# Altium schematic sheet 08 CAMERA, EXP PORT.SchDoc
size 513 x 386 mm
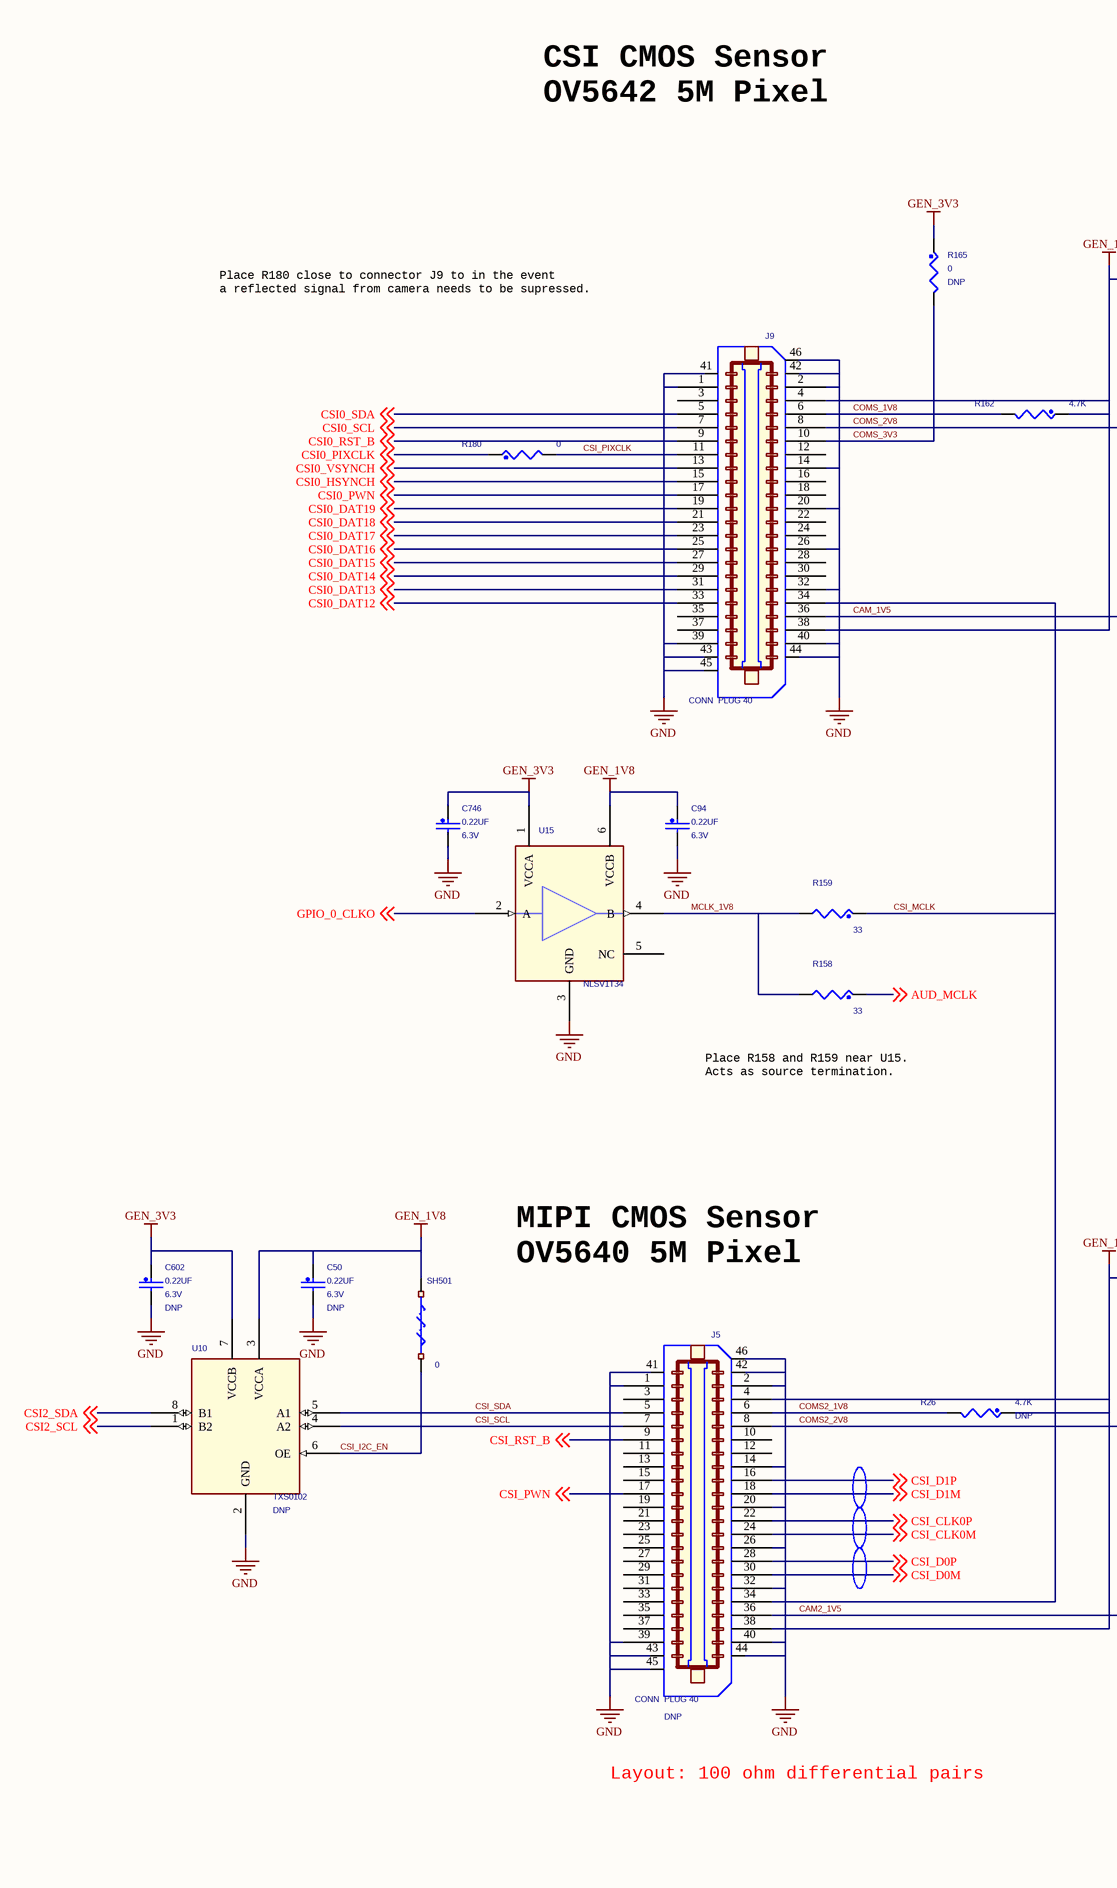
[diagram p0: 08 CAMERA, EXP PORT.SchDoc, left]
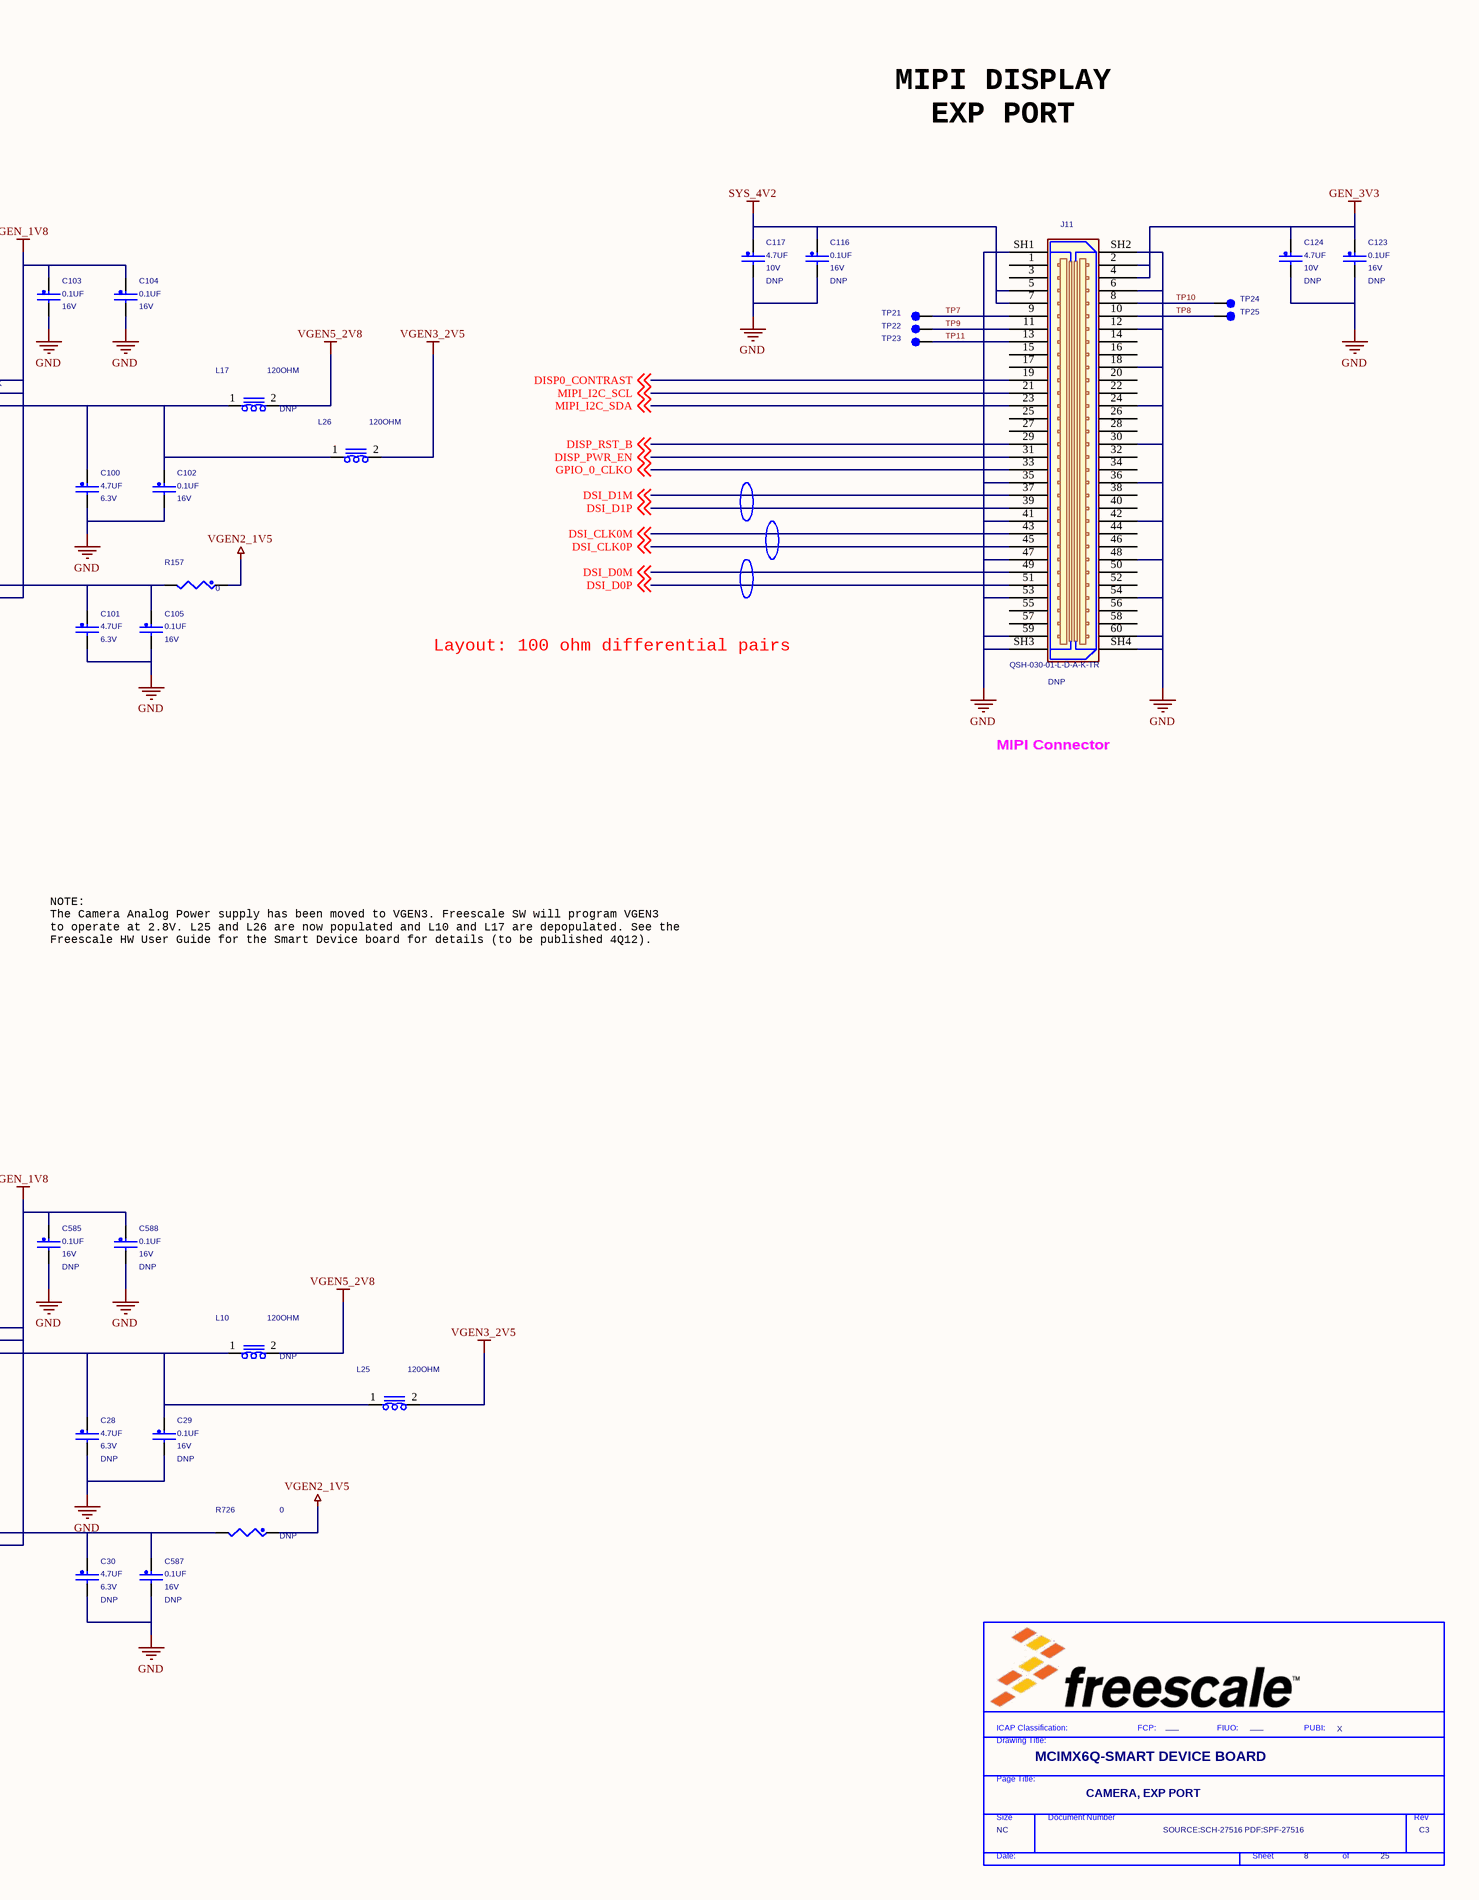
[diagram p1: 08 CAMERA, EXP PORT.SchDoc, right]

## Parts
*  FIUO: ___  PUBI: X  Doc: SOURCE:SCH-27516 PDF:SPF-27516  RevCode: C3  Title: MCIMX6Q-SMART DEVICE BOARD  Page Size: NC  Page Number: 8  Page Count: 25  PageTitle: CAMERA, EXP PORT  (hidden comment: TitleBlock_FS)  (graphical)
C28  4.7UF  WVDC: 6.3V  ASSY_OPT: DNP  [0603_CC]
C29  0.1UF  WVDC: 16V  ASSY_OPT: DNP  [0402_CC]
C30  4.7UF  ASSY_OPT: DNP  WVDC: 6.3V  [0603_CC]
C50  0.22UF  WVDC: 6.3V  ASSY_OPT: DNP  [0201_CC]
C94  0.22UF  WVDC: 6.3V  [0201_CC]
C100  4.7UF  WVDC: 6.3V  [0603_CC]
C101  4.7UF  WVDC: 6.3V  [0603_CC]
C102  0.1UF  WVDC: 16V  [0402_CC]
C103  0.1UF  WVDC: 16V  [0402_CC]
C104  0.1UF  WVDC: 16V  [0402_CC]
C105  0.1UF  WVDC: 16V  [0402_CC]
C116  0.1UF  WVDC: 16V  ASSY_OPT: DNP  [0402_CC]
C117  4.7UF  WVDC: 10V  ASSY_OPT: DNP  [0603_CC]
C123  0.1UF  WVDC: 16V  ASSY_OPT: DNP  [0402_CC]
C124  4.7UF  WVDC: 10V  ASSY_OPT: DNP  [0603_CC]
C585  0.1UF  ASSY_OPT: DNP  WVDC: 16V  [0402_CC]
C587  0.1UF  ASSY_OPT: DNP  WVDC: 16V  [0402_CC]
C588  0.1UF  ASSY_OPT: DNP  WVDC: 16V  [0402_CC]
C602  0.22UF  WVDC: 6.3V  ASSY_OPT: DNP  [0201_CC]
C746  0.22UF  WVDC: 6.3V  [0201_CC]
J5  CONN  PLUG 40  ASSY_OPT: DNP  [con_bbc_40p_0p4_sm]
J9  CONN  PLUG 40  [con_bbc_40p_0p4_sm]
J11  QSH-030-01-L-D-A-K-TR  ASSY_OPT: DNP  [CON_60S_QSH_SM_A]
L10  120OHM  ASSY_OPT: DNP  [0603_CC]
L17  120OHM  ASSY_OPT: DNP  [0603_CC]
L25  120OHM  [0603_CC]
L26  120OHM  [0603_CC]
R26  4.7K  ASSY_OPT: DNP  [0402_CC]
R157  0  [0402_CC]
R158  33  [0402_CC]
R159  33  [0402_CC]
R162  4.7K  [0402_CC]
R165  0  ASSY_OPT: DNP  [0402_CC]
R180  0  [0402_CC]
R726  0  ASSY_OPT: DNP  [0402_CC]
SH501  0  [SH0402_CC]
TP21  TEST POINT  [C035S]  (value not drawn)
TP22  TEST POINT  [C035S]  (value not drawn)
TP23  TEST POINT  [C035S]  (value not drawn)
TP24  TEST POINT  [C035S]  (value not drawn)
TP25  TEST POINT  [C035S]  (value not drawn)
U10  TXS0102  ASSY_OPT: DNP  [PSOP8]
U15  NLSV1T34  [ullga6_1p45x1_0p5mm]

## Nets
GEN_1V8: C50.1 C94.1 C103.1 C104.1 C585.1 C588.1 J5.4(P4) J5.38(P38) J9.4(P4) J9.38(P38) R26.1 R162.1 SH501.1 U10.3(VCCA) U15.6(VCCB)
GEN_3V3: C123.1 C124.1 C602.1 C746.1 J11.2 J11.4 R165.1 U10.7(VCCB) U15.1(VCCA)
GND: C28.2 C29.2 C30.2 C50.2 C94.2 C100.2 C101.2 C102.2 C103.2 C104.2 C105.2 C116.2 C117.2 C123.2 C124.2 C585.2 C587.2 C588.2 C602.2 C746.2 J5.1(P1) J5.2(P2) J5.14(P14) J5.20(P20) J5.26(P26) J5.32(P32) J5.39(P39) J5.40(P40) J5.41(P41) J5.42(P42) J5.43(P43) J5.44(P44) J5.45(P45) J5.46(P46) J9.1(P1) J9.2(P2) J9.14(P14) J9.20(P20) J9.26(P26) J9.32(P32) J9.39(P39) J9.40(P40) J9.41(P41) J9.42(P42) J9.43(P43) J9.44(P44) J9.45(P45) J9.46(P46) J11.6 J11.12 J11.18 J11.24 J11.30 J11.35 J11.36 J11.41 J11.42 J11.47 J11.48 J11.53 J11.54 J11.59 J11.60 J11.SH1 J11.SH2 J11.SH3 J11.SH4 U10.2(GND) U15.3(GND)
SYS_4V2: C116.1 C117.1 J11.5 J11.7
VGEN2_1V5: R157.1 R726.1
VGEN3_2V5: L25.2 L26.2
VGEN5_2V8: L10.2 L17.2
AUD_MCLK: R158.1 ; off-sheet AUD_MCLK
CAM2_1V5: C30.1 C587.1 J5.36(P36) R726.2
CAM_1V5: C101.1 C105.1 J9.36(P36) R157.2
COMS2_1V8: J5.6(P6) R26.2
COMS2_2V8: C28.1 C29.1 J5.8(P8) L10.1 L25.1
COMS_1V8: J9.6(P6) R162.2
COMS_2V8: C100.1 C102.1 J9.8(P8) L17.1 L26.1
COMS_3V3: J9.10(P10) R165.2
CSI0_DAT12: J9.33(P33) ; off-sheet CSI0_DAT12
CSI0_DAT13: J9.31(P31) ; off-sheet CSI0_DAT13
CSI0_DAT14: J9.29(P29) ; off-sheet CSI0_DAT14
CSI0_DAT15: J9.27(P27) ; off-sheet CSI0_DAT15
CSI0_DAT16: J9.25(P25) ; off-sheet CSI0_DAT16
CSI0_DAT17: J9.23(P23) ; off-sheet CSI0_DAT17
CSI0_DAT18: J9.21(P21) ; off-sheet CSI0_DAT18
CSI0_DAT19: J9.19(P19) ; off-sheet CSI0_DAT19
CSI0_HSYNCH: J9.15(P15) ; off-sheet CSI0_HSYNCH
CSI0_PIXCLK: R180.1 ; off-sheet CSI0_PIXCLK
CSI0_PWN: J9.17(P17) ; off-sheet CSI0_PWN
CSI0_RST_B: J9.9(P9) ; off-sheet CSI0_RST_B
CSI0_SCL: J9.7(P7) ; off-sheet CSI0_SCL
CSI0_SDA: J9.5(P5) ; off-sheet CSI0_SDA
CSI0_VSYNCH: J9.13(P13) ; off-sheet CSI0_VSYNCH
CSI2_SCL: U10.1(B2) ; off-sheet CSI2_SCL
CSI2_SDA: U10.8(B1) ; off-sheet CSI2_SDA
CSI_CLK0M: J5.24(P24) ; off-sheet CSI_CLK0M
CSI_CLK0P: J5.22(P22) ; off-sheet CSI_CLK0P
CSI_D0M: J5.30(P30) ; off-sheet CSI_D0M
CSI_D0P: J5.28(P28) ; off-sheet CSI_D0P
CSI_D1M: J5.18(P18) ; off-sheet CSI_D1M
CSI_D1P: J5.16(P16) ; off-sheet CSI_D1P
CSI_I2C_EN: SH501.2 U10.6(OE)
CSI_MCLK: J5.34(P34) J9.34(P34) R159.1
CSI_PIXCLK: J9.11(P11) R180.2
CSI_PWN: J5.17(P17) ; off-sheet CSI_PWN
CSI_RST_B: J5.9(P9) ; off-sheet CSI_RST_B
CSI_SCL: J5.7(P7) U10.4(A2)
CSI_SDA: J5.5(P5) U10.5(A1)
DISP0_CONTRAST: J11.19 ; off-sheet DISP0_CONTRAST
DISP_PWR_EN: J11.31 ; off-sheet DISP_PWR_EN
DISP_RST_B: J11.29 ; off-sheet DISP_RST_B
DSI_CLK0M: J11.43 ; off-sheet DSI_CLK0M
DSI_CLK0P: J11.45 ; off-sheet DSI_CLK0P
DSI_D0M: J11.49 ; off-sheet DSI_D0M
DSI_D0P: J11.51 ; off-sheet DSI_D0P
DSI_D1M: J11.37 ; off-sheet DSI_D1M
DSI_D1P: J11.39 ; off-sheet DSI_D1P
GPIO_0_CLKO: J11.33 U15.2(A) ; off-sheet GPIO_0_CLKO
MCLK_1V8: R158.2 R159.2 U15.4(B)
MIPI_I2C_SCL: J11.21 ; off-sheet MIPI_I2C_SCL
MIPI_I2C_SDA: J11.23 ; off-sheet MIPI_I2C_SDA
TP7: J11.9 TP21.1(Pin1)
TP8: J11.10 TP25.1(Pin1)
TP9: J11.11 TP22.1(Pin1)
TP10: J11.8 TP24.1(Pin1)
TP11: J11.13 TP23.1(Pin1)

Not connected (* = marked no-connect by the designer): J5 3(P3) 10(P10) 11(P11) 12(P12) 13(P13) 15(P15) 19(P19) 21(P21) 23(P23) 25(P25) 27(P27) 29(P29) 31(P31) 33(P33) 35(P35) 37(P37); J9 3(P3) 12(P12) 16(P16) 18(P18) 22(P22) 24(P24) 28(P28) 30(P30) 35(P35) 37(P37); J11 1 3 14 15 16 17 20 22 25 26 27 28 32 34 38 40 44 46 50 52 55 56 57 58; U15 5(NC)

## Notes on the sheet
- CSI CMOS Sensor
  OV5642 5M Pixel
- MIPI DISPLAY
  EXP PORT
- Place R180 close to connector J9 to in the event
  a reflected signal from camera needs to be supressed.
- Layout: 100 ohm differential pairs
- MIPI Connector
- NOTE:
  The Camera Analog Power supply has been moved to VGEN3. Freescale SW will program VGEN3
  to operate at 2.8V. L25 and L26 are now populated and L10 and L17 are depopulated. See the
  Freescale HW User Guide for the Smart Device board for details (to be published 4Q12).
- Place R158 and R159 near U15.
  Acts as source termination.
- MIPI CMOS Sensor
  OV5640 5M Pixel
- (in symbol TitleBlock_FS) ICAP Classification:; FCP:; FIUO:; PUBI:; Drawing Title:; Page Title:; Size; Document Number; Rev; Date:; Sheet; of

## Library data of the parts
* = TitleBlock_FS: OrgAddr2: Austin, TX 78735-8598; OrgAddr1: 6501 William Cannon Drive West; OrgName: Freescale Semiconductor; FCP: ___; Page Create Date: March  8, 1995
C28 = CAP_NP: CAP CER 4.7UF 6.3V 10% X5R 0603; CLASS: DISCRETE; AGILE_PN: 150-75487; MFG_NAME01: VENKEL COMPANY; MFG_PN01: C0603X5R6R3-475KNP; CAD_APPROVED: Yes; FPLIST: CC0603_OV,CC0603,0603_CC; SIGNAL_MODEL: DEFAULT_CAPACITOR_4.7e+06pF_2_1; Tolerance: 10%; TOL: 10%; ROHS: Yes; HEIGHT: 1.016MM; VOLTAGE: 6.3V
C29 C116 = CAP_NP: CAP CER 0.1UF 16V 10% X7R 0402; CLASS: DISCRETE; AGILE_PN: 150-75182; MFG_NAME01: KEMET; MFG_PN01: C0402C104K4RAC; CAD_APPROVED: Yes; FPLIST: CC0402_25,CC0402_HD,0402_CC; SIGNAL_MODEL: DEFAULT_CAPACITOR_100000pF_2_1; Tolerance: 10%; ROHS: Yes; HEIGHT: 0.635MM; VOLTAGE: 16V
C30 C101 = CAP_NP: CAP CER 4.7UF 6.3V 10% X5R 0603; CLASS: DISCRETE; SIGNAL_MODEL: DEFAULT_CAPACITOR_4.7e+06pF_2_1; FPLIST: CC0603_OV,CC0603,0603_CC; CAD_APPROVED: Yes; MFG_PN01: C0603X5R6R3-475KNP; MFG_NAME01: VENKEL COMPANY; AGILE_PN: 150-75487; VOLTAGE: 6.3V; HEIGHT: 1.016MM; ROHS: Yes; TOL: 10%; Tolerance: 10%
C50 C602 = CAP_NP: CAP CER 0.22UF 6.3V 20% X5R 0201; CLASS: DISCRETE; SIGNAL_MODEL: DEFAULT_CAPACITOR_220000pF_2_1; ROOM: CPU; AGILE_PN: 150-77852; MFG_NAME01: TAIYO YUDEN; MFG_PN01: JMK063BJ224MP-F; CAD_APPROVED: Yes; FPLIST: CC0201,CC0201_HD,0201_CC,cc_0201_cir; PRIORITY_PN: 021-00278; VOLTAGE: 6.3V; Tolerance: 20%; ROHS: Yes; HEIGHT: 0.33 MM
C94 C746 = CAP_NP: CAP CER 0.22UF 6.3V 20% X5R 0201; CLASS: DISCRETE; SIGNAL_MODEL: DEFAULT_CAPACITOR_220000pF_2_1; PRIORITY_PN: 021-00278; FPLIST: CC0201,CC0201_HD,0201_CC,cc_0201_cir; CAD_APPROVED: Yes; MFG_PN01: JMK063BJ224MP-F; MFG_NAME01: TAIYO YUDEN; AGILE_PN: 150-77852; ROOM: CPU; VOLTAGE: 6.3V; HEIGHT: 0.33 MM; ROHS: Yes; Tolerance: 20%
C100 = CAP_NP: CAP CER 4.7UF 6.3V 10% X5R 0603; CLASS: DISCRETE; FPLIST: CC0603_OV,CC0603,0603_CC; CAD_APPROVED: Yes; MFG_PN01: C0603X5R6R3-475KNP; MFG_NAME01: VENKEL COMPANY; AGILE_PN: 150-75487; SIGNAL_MODEL: DEFAULT_CAPACITOR_4.7e+06pF_2_1; HEIGHT: 1.016MM; ROHS: Yes; TOL: 10%; Tolerance: 10%; VOLTAGE: 6.3V
C102 C123 = CAP_NP: CAP CER 0.1UF 16V 10% X7R 0402; CLASS: DISCRETE; FPLIST: CC0402_25,CC0402_HD,0402_CC; CAD_APPROVED: Yes; MFG_PN01: C0402C104K4RAC; MFG_NAME01: KEMET; AGILE_PN: 150-75182; SIGNAL_MODEL: DEFAULT_CAPACITOR_100000pF_2_1; HEIGHT: 0.635MM; ROHS: Yes; Tolerance: 10%; VOLTAGE: 16V
C103 C105 C588 = CAP_NP: CAP CER 0.1UF 16V 10% X7R 0402; CLASS: DISCRETE; SIGNAL_MODEL: DEFAULT_CAPACITOR_100000pF_2_1; AGILE_PN: 150-75182; MFG_NAME01: KEMET; MFG_PN01: C0402C104K4RAC; CAD_APPROVED: Yes; FPLIST: CC0402_25,CC0402_HD,0402_CC; VOLTAGE: 16V; Tolerance: 10%; ROHS: Yes; HEIGHT: 0.635MM
C104 C585 C587 = CAP_NP: CAP CER 0.1UF 16V 10% X7R 0402; CLASS: DISCRETE; SIGNAL_MODEL: DEFAULT_CAPACITOR_100000pF_2_1; FPLIST: CC0402_25,CC0402_HD,0402_CC; CAD_APPROVED: Yes; MFG_PN01: C0402C104K4RAC; MFG_NAME01: KEMET; AGILE_PN: 150-75182; VOLTAGE: 16V; HEIGHT: 0.635MM; ROHS: Yes; Tolerance: 10%
C117 C124 = CAP_NP: CAP CER 4.7UF 10V 10% X5R 0603; CLASS: DISCRETE; PRIORITY_PN: 921-00228; CAD_APPROVED: Yes; MFG_PN01: LMK107BJ475KA-T; MFG_NAME01: TAIYO YUDEN; AGILE_PN: 150-77975; ROOM: DISP1; FPLIST: CC0603_OV,CC0603,0603_CC; SIGNAL_MODEL: DEFAULT_CAPACITOR_4.7e+06pF_2_1; VOLTAGE: 10V; HEIGHT: 0.9MM; ROHS: Yes; Tolerance: 10%
J5 J9 = FX12B-40P: CON 2X20 PLUG SHLD SMT 0.4MM SP 53H AU; CLASS: IO; AGILE_PN: 211-77122; MFG_NAME01: Hirose; MFG_PN01: FX12B-40P-0.4SV; CAD_APPROVED: Yes; ROHS: Yes; HEIGHT: 1.64MM
J11 = QSH030: CON 2X30 SKT SMT 0.5MM SP 120H AU  MOUNTING HOLES TO MATE CABLE HQCD-030-15.00-TBL-TBR-1-SDB; CLASS: IO; PRIORITY_PN: 009-00665; FPLIST: CON_60S_QSH_SM_A,CON_60S_QSH_SM; CAD_APPROVED: Yes; MFG_PN01: QSH-030-01-L-D-A_; MFG_NAME01: SAMTEC; AGILE_PN: 211-75161; HEIGHT: 3.25 MM; ROHS: Yes
L10 L26 = BEAD_0: IND FER BEAD 120OHM@100MHZ 2A 25% 0603; PART_TYPE: FERRITE; CLASS: DISCRETE; ROOM: RGMII_PHY; MFG_PN01: BLM18PG121SH1; AGILE_PN: 180-30008; FPLIST: IND_0603,0603_CC; CAD_APPROVED: Yes; MFG_NAME01: MURATA; PRIORITY_PN: 024-00067; ROHS: Yes; HEIGHT: 0.95MM; Tolerance: 25%
L17 L25 = BEAD_0: IND FER BEAD 120OHM@100MHZ 2A 25% 0603; PART_TYPE: FERRITE; CLASS: DISCRETE; PRIORITY_PN: 024-00067; MFG_NAME01: MURATA; CAD_APPROVED: Yes; FPLIST: IND_0603,0603_CC; AGILE_PN: 180-30008; MFG_PN01: BLM18PG121SH1; ROOM: RGMII_PHY; Tolerance: 25%; HEIGHT: 0.95MM; ROHS: Yes
R26 = RES: RES MF 4.70K 1/16W 1% 0402; CLASS: DISCRETE; SIGNAL_MODEL: DEFAULT_RESISTOR_4700OHM_2_1; FPLIST: RC0402_25,RC0402_HD,0402_CC; CAD_APPROVED: Yes; MFG_PN01: RK73H1ETTP4701F; MFG_NAME01: KOA SPEER; AGILE_PN: 470-75418; Tolerance: 1%; HEIGHT: 0.55 MM; ROHS: Yes; TOL: 1%
R157 R180 = RES: RES MF ZERO OHM 1/10W -- 0402; CLASS: DISCRETE; SIGNAL_MODEL: DEFAULT_RESISTOR_0.001OHM_2_1; AGILE_PN: 470-79965; MFG_NAME01: Panasonic; MFG_PN01: ERJ-2GE0R00X; CAD_APPROVED: Yes; FPLIST: RC0402_25,RC0402_HD,RC0402_X2,0402_CC; ROHS: Yes
R158 R159 = RES: RES MF 33 OHM 1/16W 5% 0402; CLASS: DISCRETE; SIGNAL_MODEL: DEFAULT_RESISTOR_33OHM_2_1; FPLIST: RC0402_25,RC0402_HD,0402_CC; CAD_APPROVED: Yes; MFG_PN01: RC73L2Z330JTF; MFG_NAME01: SMEC; TOL: 1%; AGILE_PN: 470-75634; Tolerance: 5%; HEIGHT: 0.55 mm; ROHS: Yes
R162 = RES: RES MF 4.70K 1/16W 1% 0402; CLASS: DISCRETE; SIGNAL_MODEL: DEFAULT_RESISTOR_4700OHM_2_1; AGILE_PN: 470-75418; MFG_NAME01: KOA SPEER; MFG_PN01: RK73H1ETTP4701F; CAD_APPROVED: Yes; FPLIST: RC0402_25,RC0402_HD,0402_CC; TOL: 1%; ROHS: Yes; HEIGHT: 0.55 MM; Tolerance: 1%
R165 = RES: RES MF ZERO OHM 1/10W -- 0402; CLASS: DISCRETE; SIGNAL_MODEL: DEFAULT_RESISTOR_0.001OHM_2_1; FPLIST: RC0402_25,RC0402_HD,RC0402_X2,0402_CC; CAD_APPROVED: Yes; MFG_PN01: ERJ-2GE0R00X; MFG_NAME01: Panasonic; AGILE_PN: 470-79965; ROHS: Yes
R726 = RES: RES MF ZERO OHM 1/10W -- 0402; CLASS: DISCRETE; AGILE_PN: 470-79965; MFG_NAME01: Panasonic; MFG_PN01: ERJ-2GE0R00X; CAD_APPROVED: Yes; FPLIST: RC0402_25,RC0402_HD,RC0402_X2,0402_CC; SIGNAL_MODEL: DEFAULT_RESISTOR_0.001OHM_2_1; ROHS: Yes
SH501 = RES_SHORT-2: ZERO OHM CUT TRACE 0402 PADS; NO PART TO ORDER; CLASS: DISCRETE; FPLIST: SH0402,SH0402_CC; CAD_APPROVED: Yes; ASSY_OPT: DNP; MFG_PN01: LAYOUT ELEMENT ONLY; AGILE_PN: 470-76449; ROHS: Yes; MFG_NAME01: LAYOUT ELEMENT ONLY
TP21 TP22 TP25 = Test pad: TEST POINT PAD 35 MIL SMT, NO PART TO ORDER; CLASS: IC; AGILE_PN: 280-75148; MFG_NAME01: NA; ASSY_OPT: DNP; CAD_APPROVED: Yes; MFG_PN01: NA; ROHS: Yes; HEIGHT: 0.1 MM
TP23 TP24 = Test pad: TEST POINT PAD 35 MIL SMT, NO PART TO ORDER; CLASS: IC; CAD_APPROVED: Yes; ASSY_OPT: DNP; MFG_PN01: NA; AGILE_PN: 280-75148; HEIGHT: 0.1 MM; ROHS: Yes; MFG_NAME01: NA
U10 = TXB0102: IC VXLTR 2BIT 1.65-3.6V/2.3-5.5V SOT70-8; FPLIST: PSOP8,psop8_a; CAD_APPROVED: Yes; MFG_PN01: TXS0102DCUR; MFG_NAME01: TEXAS INSTRUMENTS; AGILE_PN: 315-78892; CLASS: IC; HEIGHT: 0.9MM; ROHS: Yes
U15 = NLSV1T34: IC VXLTR 1 BIT DUAL-SUPPLY 0.9-4.5V 613AF; CAD_APPROVED: Yes; MFG_PN01: NLSV1T34AMX1TCG; MFG_NAME01: On Semiconductor; AGILE_PN: 312-79552; CLASS: IC; HEIGHT: 0.4MM; ROHS: Yes